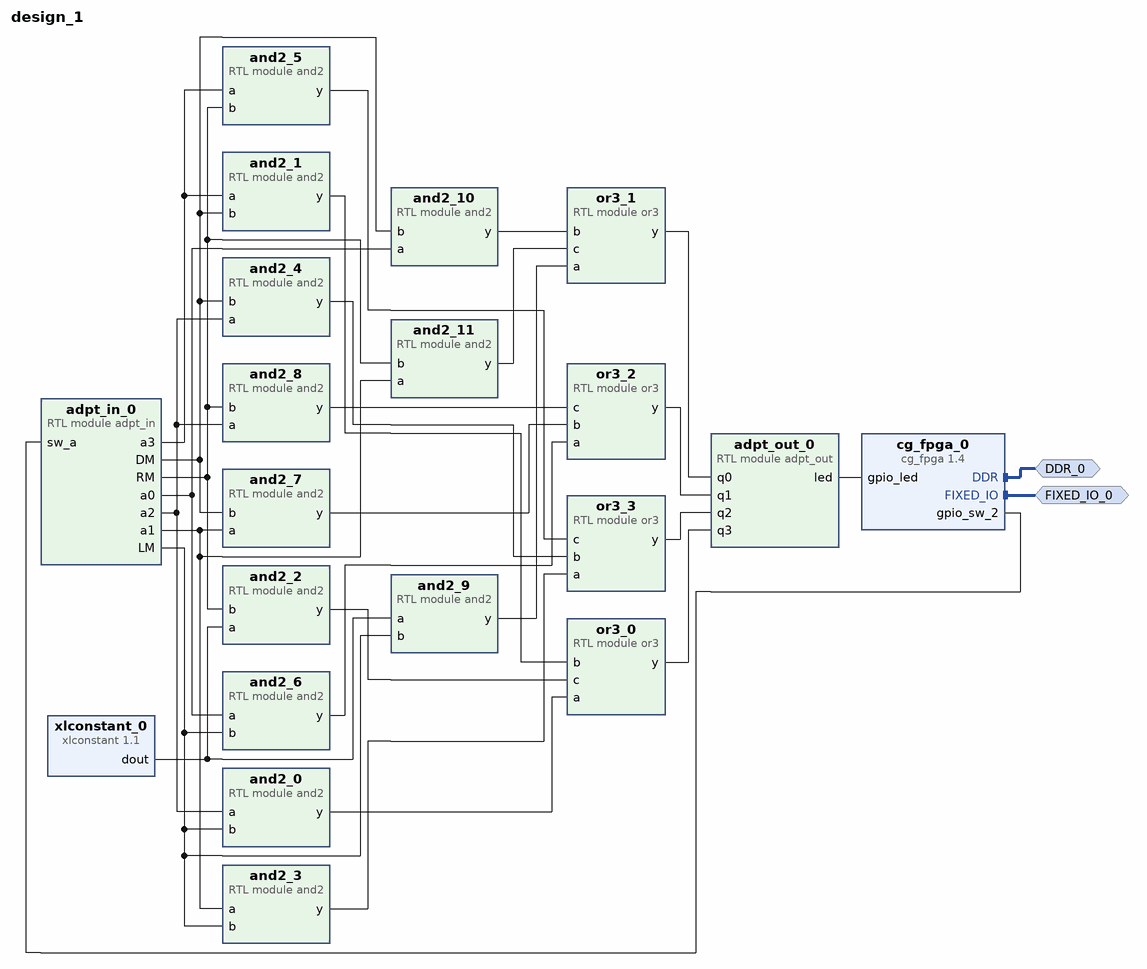
[diagram p0: block diagram of the top level]
# Vivado block design design_1, xc7z020clg400-1, Vivado 2025.2
create_bd_design design_1

create_bd_intf_port -mode Master -vlnv xilinx.com:display_processing_system7:fixedio_rtl:1.0 FIXED_IO_0
create_bd_intf_port -mode Master -vlnv xilinx.com:interface:ddrx_rtl:1.0 DDR_0

create_bd_cell -type ip -vlnv educg.net:user:cg_fpga:1.4 cg_fpga_0
create_bd_cell -type module -reference adpt_in adpt_in_0
create_bd_cell -type module -reference and2 and2_0
create_bd_cell -type module -reference and2 and2_1
create_bd_cell -type module -reference and2 and2_2
create_bd_cell -type ip -vlnv xilinx.com:ip:xlconstant:1.1 xlconstant_0
set_property -dict {CONFIG.CONST_VAL 0} [get_bd_cells xlconstant_0]
create_bd_cell -type module -reference and2 and2_3
create_bd_cell -type module -reference and2 and2_4
create_bd_cell -type module -reference and2 and2_5
create_bd_cell -type module -reference and2 and2_6
create_bd_cell -type module -reference and2 and2_7
create_bd_cell -type module -reference and2 and2_8
create_bd_cell -type module -reference and2 and2_9
create_bd_cell -type module -reference and2 and2_10
create_bd_cell -type module -reference and2 and2_11
create_bd_cell -type module -reference or3 or3_0
create_bd_cell -type module -reference adpt_out adpt_out_0
create_bd_cell -type module -reference or3 or3_1
create_bd_cell -type module -reference or3 or3_2
create_bd_cell -type module -reference or3 or3_3

# ---- connections ----

connect_bd_intf_net [get_bd_intf_ports DDR_0] [get_bd_intf_pins cg_fpga_0/DDR]
connect_bd_intf_net [get_bd_intf_ports FIXED_IO_0] [get_bd_intf_pins cg_fpga_0/FIXED_IO]
connect_bd_net [get_bd_pins adpt_in_0/DM] [get_bd_pins and2_1/b] [get_bd_pins and2_4/b] [get_bd_pins and2_7/b] [get_bd_pins and2_10/b]
connect_bd_net [get_bd_pins adpt_in_0/LM] [get_bd_pins and2_0/b] [get_bd_pins and2_3/b] [get_bd_pins and2_6/b] [get_bd_pins and2_9/b]
connect_bd_net [get_bd_pins adpt_in_0/RM] [get_bd_pins and2_2/b] [get_bd_pins and2_5/b] [get_bd_pins and2_8/b] [get_bd_pins and2_11/b]
connect_bd_net [get_bd_pins adpt_in_0/a0] [get_bd_pins and2_6/a] [get_bd_pins and2_10/a]
connect_bd_net [get_bd_pins adpt_in_0/a1] [get_bd_pins and2_3/a] [get_bd_pins and2_7/a] [get_bd_pins and2_11/a]
connect_bd_net [get_bd_pins adpt_in_0/a2] [get_bd_pins and2_0/a] [get_bd_pins and2_4/a] [get_bd_pins and2_8/a]
connect_bd_net [get_bd_pins adpt_in_0/a3] [get_bd_pins and2_1/a] [get_bd_pins and2_5/a]
connect_bd_net [get_bd_pins adpt_out_0/led] [get_bd_pins cg_fpga_0/gpio_led]
connect_bd_net [get_bd_pins and2_0/y] [get_bd_pins or3_0/a]
connect_bd_net [get_bd_pins and2_10/y] [get_bd_pins or3_1/b]
connect_bd_net [get_bd_pins and2_11/y] [get_bd_pins or3_1/c]
connect_bd_net [get_bd_pins and2_1/y] [get_bd_pins or3_0/b]
connect_bd_net [get_bd_pins and2_2/y] [get_bd_pins or3_0/c]
connect_bd_net [get_bd_pins and2_3/y] [get_bd_pins or3_3/a]
connect_bd_net [get_bd_pins and2_4/y] [get_bd_pins or3_3/b]
connect_bd_net [get_bd_pins and2_5/y] [get_bd_pins or3_3/c]
connect_bd_net [get_bd_pins and2_6/y] [get_bd_pins or3_2/a]
connect_bd_net [get_bd_pins and2_7/y] [get_bd_pins or3_2/b]
connect_bd_net [get_bd_pins and2_8/y] [get_bd_pins or3_2/c]
connect_bd_net [get_bd_pins and2_9/y] [get_bd_pins or3_1/a]
connect_bd_net [get_bd_pins cg_fpga_0/gpio_sw_2] [get_bd_pins adpt_in_0/sw_a]
connect_bd_net [get_bd_pins or3_0/y] [get_bd_pins adpt_out_0/q3]
connect_bd_net [get_bd_pins or3_1/y] [get_bd_pins adpt_out_0/q0]
connect_bd_net [get_bd_pins or3_2/y] [get_bd_pins adpt_out_0/q1]
connect_bd_net [get_bd_pins or3_3/y] [get_bd_pins adpt_out_0/q2]
connect_bd_net [get_bd_pins xlconstant_0/dout] [get_bd_pins and2_2/a] [get_bd_pins and2_9/a]

validate_bd_design
save_bd_design
